# EAGLE design d1-stepper-shield (EAGLE 9.6.2)
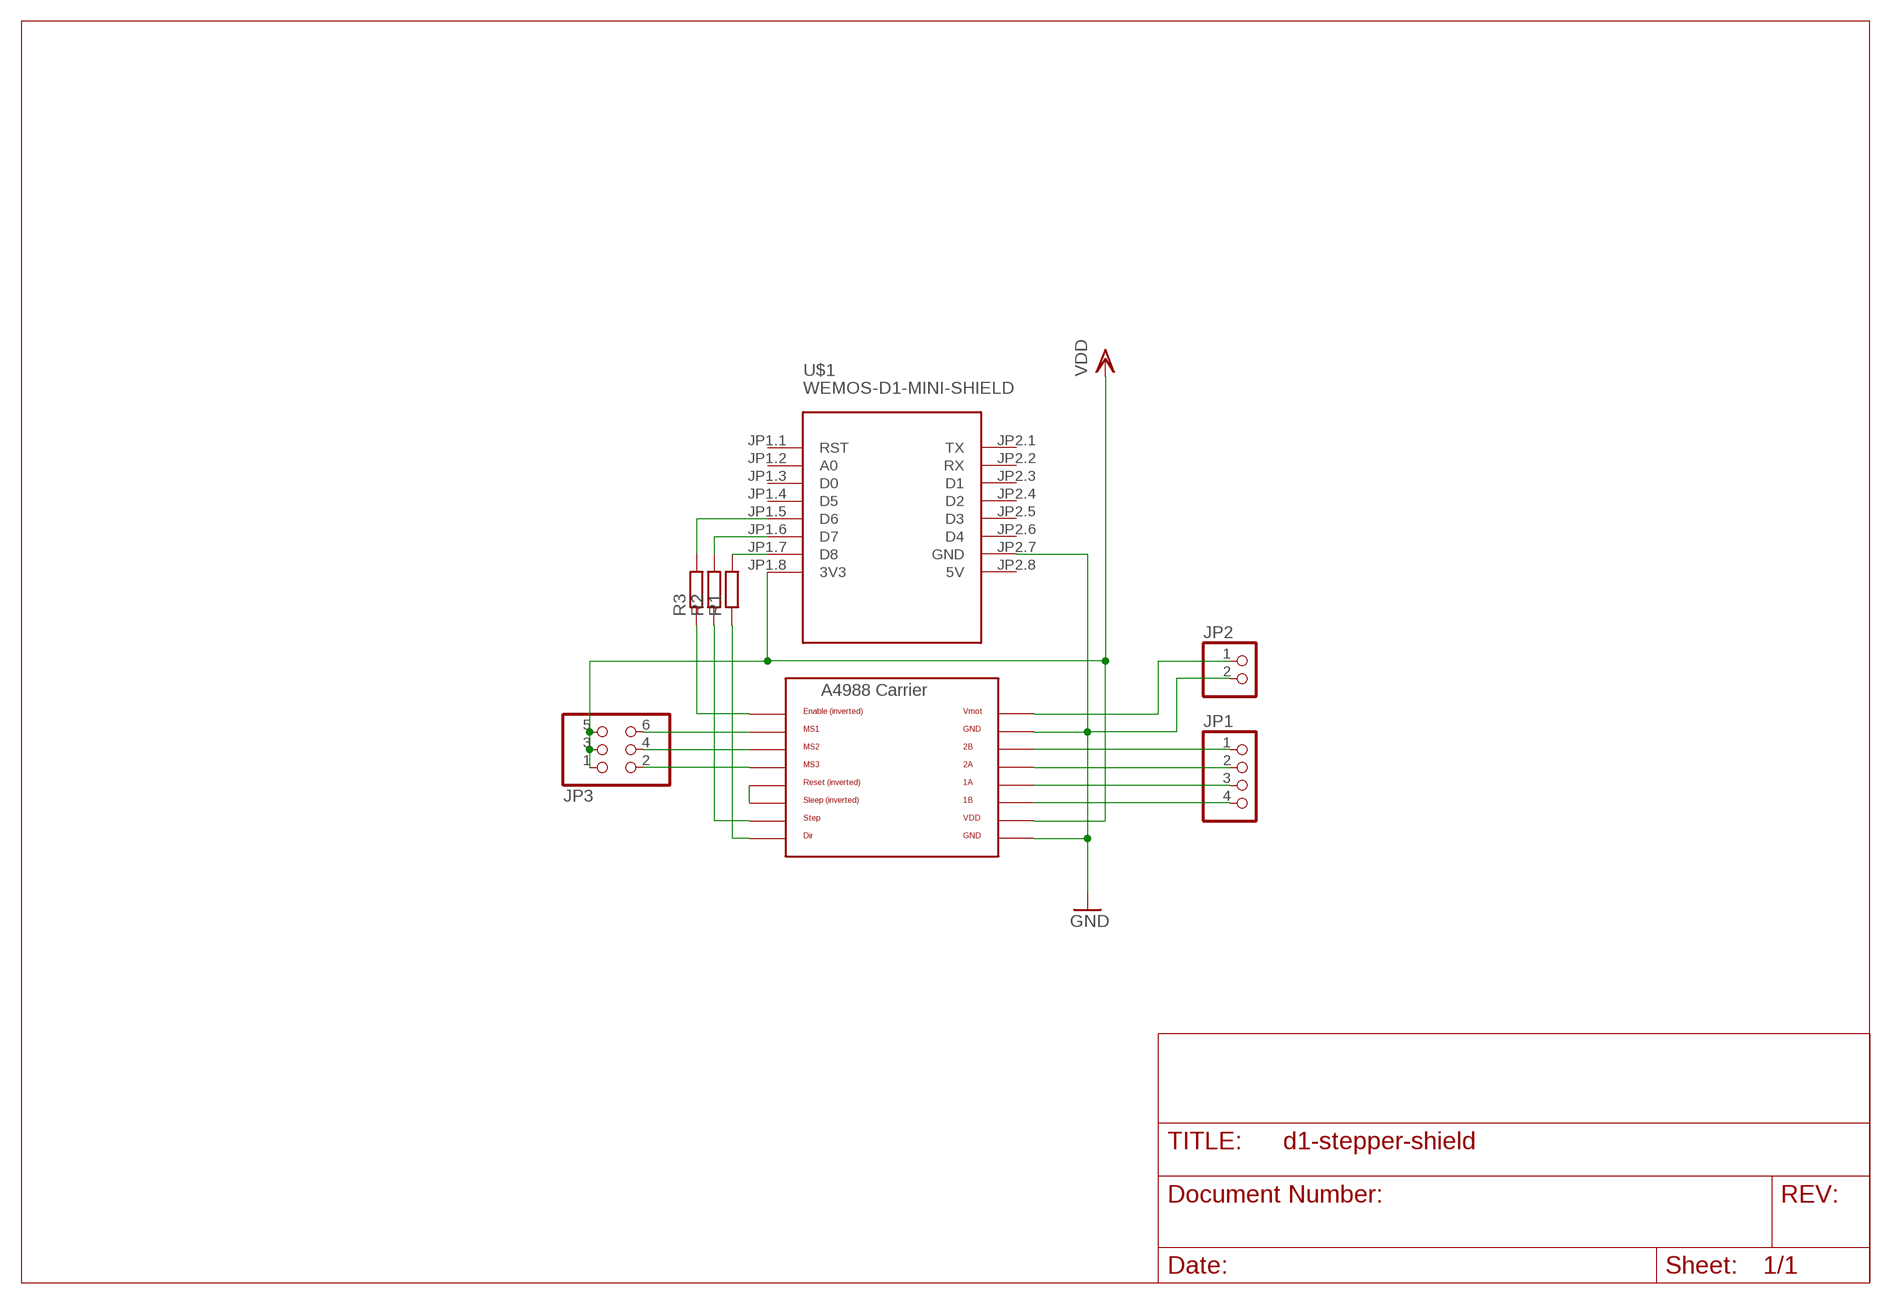
[diagram p0: schematic, sheet 1]

## Parts
JP1  PINHD-1X4  [1X04]
JP2  PINHD-1X2  [1X02]
JP3  PINHD-2X3  [2X03]
R1  R-EU_R0603  [R0603]
R2  R-EU_R0603  [R0603]
R3  R-EU_R0603  [R0603]
U$1  WEMOS-D1-MINI-SHIELD  [WEMOS-D1-MINI-SHIELD]
U$2  A4988BREAKOUT  [A4988BREAKOUT]

## Nets
GND: JP2.2 U$1.JP2.7(GND) U$2.GND U$2.GND@0(GND)
N$1: JP1.1 U$2.2B
N$2: JP1.2 U$2.2A
N$3: JP1.3 U$2.1A
N$4: JP1.4 U$2.1B
N$5: JP3.6 U$2.MS1
N$6: JP2.1 U$2.VMOT
N$7: U$2.RST U$2.SLP(SLEEP)
N$8: JP3.2 U$2.MS3
N$9: JP3.4 U$2.MS2
N$10: R1.1 U$2.DIR
N$11: R2.1 U$2.STEP
N$12: R1.2 U$1.JP1.7(D8)
N$13: R2.2 U$1.JP1.6(D7)
N$14: R3.2 U$1.JP1.5(D6)
N$15: R3.1 U$2.EN
VDD: JP3.1 JP3.3 JP3.5 U$1.JP1.8(3V3) U$2.VDD
Unconnected: U$1.JP1.1(RST) U$1.JP1.2(A0) U$1.JP1.3(D0) U$1.JP1.4(D5) U$1.JP2.1(TX) U$1.JP2.2(RX) U$1.JP2.3(D1) U$1.JP2.4(D2) U$1.JP2.5(D3) U$1.JP2.6(D4)

## Power pins joined to a net without a drawn wire
5V: U$1.JP2.8(5V)

## Library data of the parts
JP1 = pinhead:PINHD-1X4: PIN HEADER
JP2 = pinhead:PINHD-1X2: PIN HEADER
JP3 = pinhead:PINHD-2X3: PIN HEADER
R1-R3 = rcl:R-EU_: RESISTOR, European symbol; SPICEPREFIX: R
U$1 = diy-modules:WEMOS-D1-MINI-SHIELD: Template for WEMOS D1 mini compatible shields NOTICE: This is a template only. You can use it as a base to create symbols for WEMOS D1 mini compatible shields. Official list of available shields can be found here: https://www.wemos.cc/D1-mini-Shields
U$2 = RepRapjr:A4988BREAKOUT

## Board
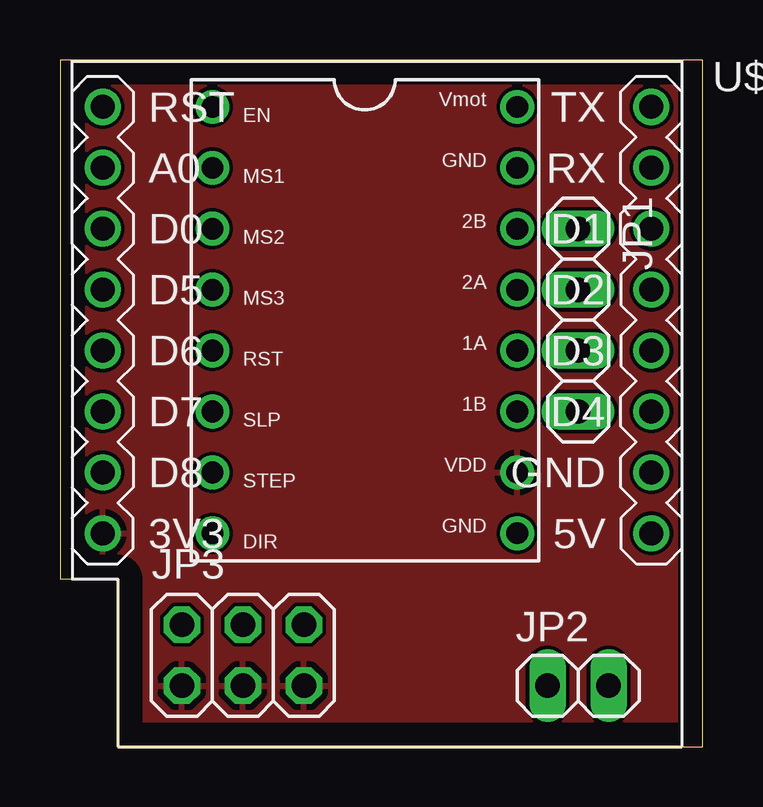
[diagram p1: board, top side]
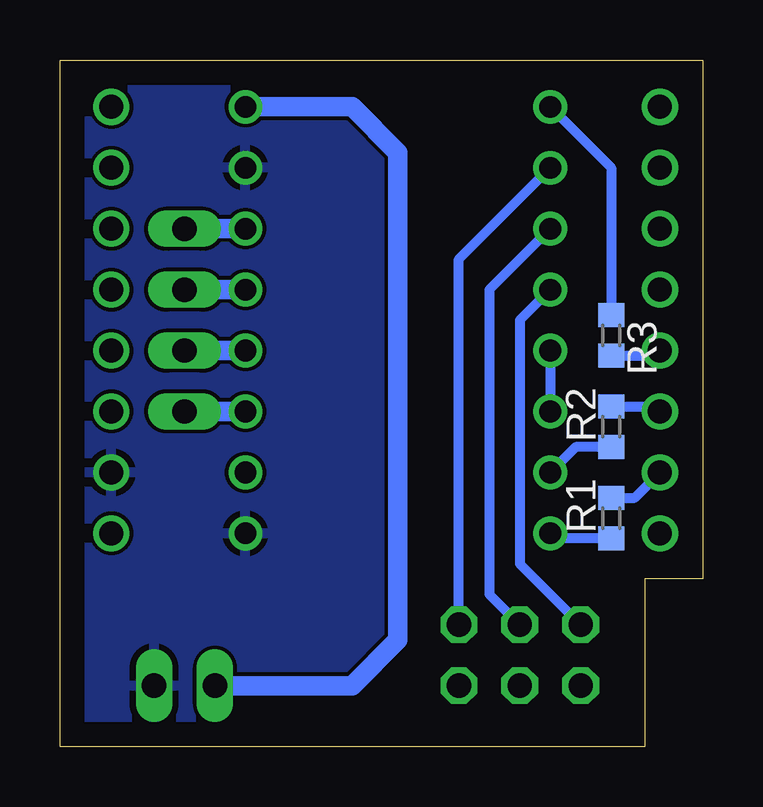
[diagram p2: board, bottom side, seen from below]

Size 26.78 x 28.63 mm. Coordinates in mm from the lower left corner, seen from the top.
Outline: 2.41,0 26.78,0 26.78,28.63 0,28.63 0,6.99 2.41,6.99 2.41,0
Copper layers (1*16): Top 0.035mm / dielectric 1.5mm / Bottom 0.035mm
Design rules "default": minimum track width 6mil, minimum drill 0.35mm, track to track 6mil, track to pad 6mil, pad to pad 6mil, via to via 6mil, smd to smd 6mil, copper to edge 40mil, drill to drill 6mil, minimum pad ring 10mil, minimum via ring 8mil, stop-mask expansion 4mil, vias tented up to drill 0mil, thermal gap 10mil

### Footprints (pad centres in the part's own frame; a part is rotated, then mirrored left to right if it is on the bottom)
1X04 = drill 1.016 long: 1 -3.81,0; 2 -1.27,0; 3 1.27,0; 4 3.81,0
1X02 = drill 1.016 long: 1 -1.27,0; 2 1.27,0
2X03 = drill 1.016 octagon: 1 -2.54,-1.27; 2 -2.54,1.27; 3 0,-1.27; 4 0,1.27; 5 2.54,-1.27; 6 2.54,1.27
R0603 = smd 1 x 1.1: 1 -0.85,0; 2 0.85,0
WEMOS-D1-MINI-SHIELD = drill 1: JP1.1 -11.43,12.065; JP1.2 -11.43,9.525; JP1.3 -11.43,6.985; JP1.4 -11.43,4.445; JP1.5 -11.43,1.905; JP1.6 -11.43,-0.635; JP1.7 -11.43,-3.175; JP1.8 -11.43,-5.715; JP2.1 11.43,12.065; JP2.2 11.43,9.525; JP2.3 11.43,6.985; JP2.4 11.43,4.445; JP2.5 11.43,1.905; JP2.6 11.43,-0.635; JP2.7 11.43,-3.175; JP2.8 11.43,-5.715
A4988BREAKOUT = drill 0.9: 1A 8.89,1.27; 1B 11.43,1.27; 2A 6.35,1.27; 2B 3.81,1.27; DIR 16.51,-11.43; EN -1.27,-11.43; GND 16.51,1.27; GND@0 1.27,1.27; MS1 1.27,-11.43; MS2 3.81,-11.43; MS3 6.35,-11.43; RST 8.89,-11.43; SLP 11.43,-11.43; STEP 13.97,-11.43; VDD 13.97,1.27; VMOT -1.27,1.27

### Placement (x,y rotation side)
JP1  21.59,17.78 270 top
JP2  21.59,2.54 0 top
JP3  7.62,3.81 0 top
R1  3.81,9.53 90 bottom
R2  3.81,13.34 90 bottom
R3  3.81,17.14 270 bottom
U$1  13.21,14.61 0 top
U$2  17.78,25.4 270 top

### Tracks (layer width: path | path; a pad name or v marks a point on that pad's centre or on a via)
GND
  pour Bottom: 0,6.99 2.54,6.99 2.54,0 26.67,0 26.67,28.57 0,28.57
N$1
  Bottom 0.813: U$2.2B JP1.1
N$2
  Bottom 0.813: U$2.2A JP1.2
N$3
  Bottom 0.813: U$2.1A JP1.3
N$4
  Bottom 0.813: U$2.1B JP1.4
N$5
  Bottom 0.406: JP3.6 10.16,20.32 U$2.MS1
N$6
  Bottom 0.813: U$2.VMOT 14.61,26.67 12.7,24.77 12.7,4.45 14.61,2.54 JP2.1
N$7
  Bottom 0.406: U$2.RST U$2.SLP
N$8
  Bottom 0.406: JP3.2 7.62,7.62 7.62,17.78 U$2.MS3
N$9
  Bottom 0.406: U$2.MS2 8.89,19.05 8.89,6.35 JP3.4
N$10
  Bottom 0.406: R1.1 6.13,8.68 U$2.DIR
N$11
  Bottom 0.406: R2.1 5.29,12.48 U$2.STEP
N$12
  Bottom 0.406: R1.2 2.83,10.38 U$1.JP1.7
N$13
  Bottom 0.406: R2.2 1.99,14.19 U$1.JP1.6
N$14
  Bottom 0.406: R3.2 1.99,16.3 U$1.JP1.5
N$15
  Bottom 0.406: U$2.EN 3.81,24.13 R3.1
VDD
  pour Top: 0,28.57 0,6.99 2.54,6.99 2.54,0 26.67,0 26.67,28.57